# Altium schematic sheet sh_stepper.SchDoc
size 457 x 241 mm
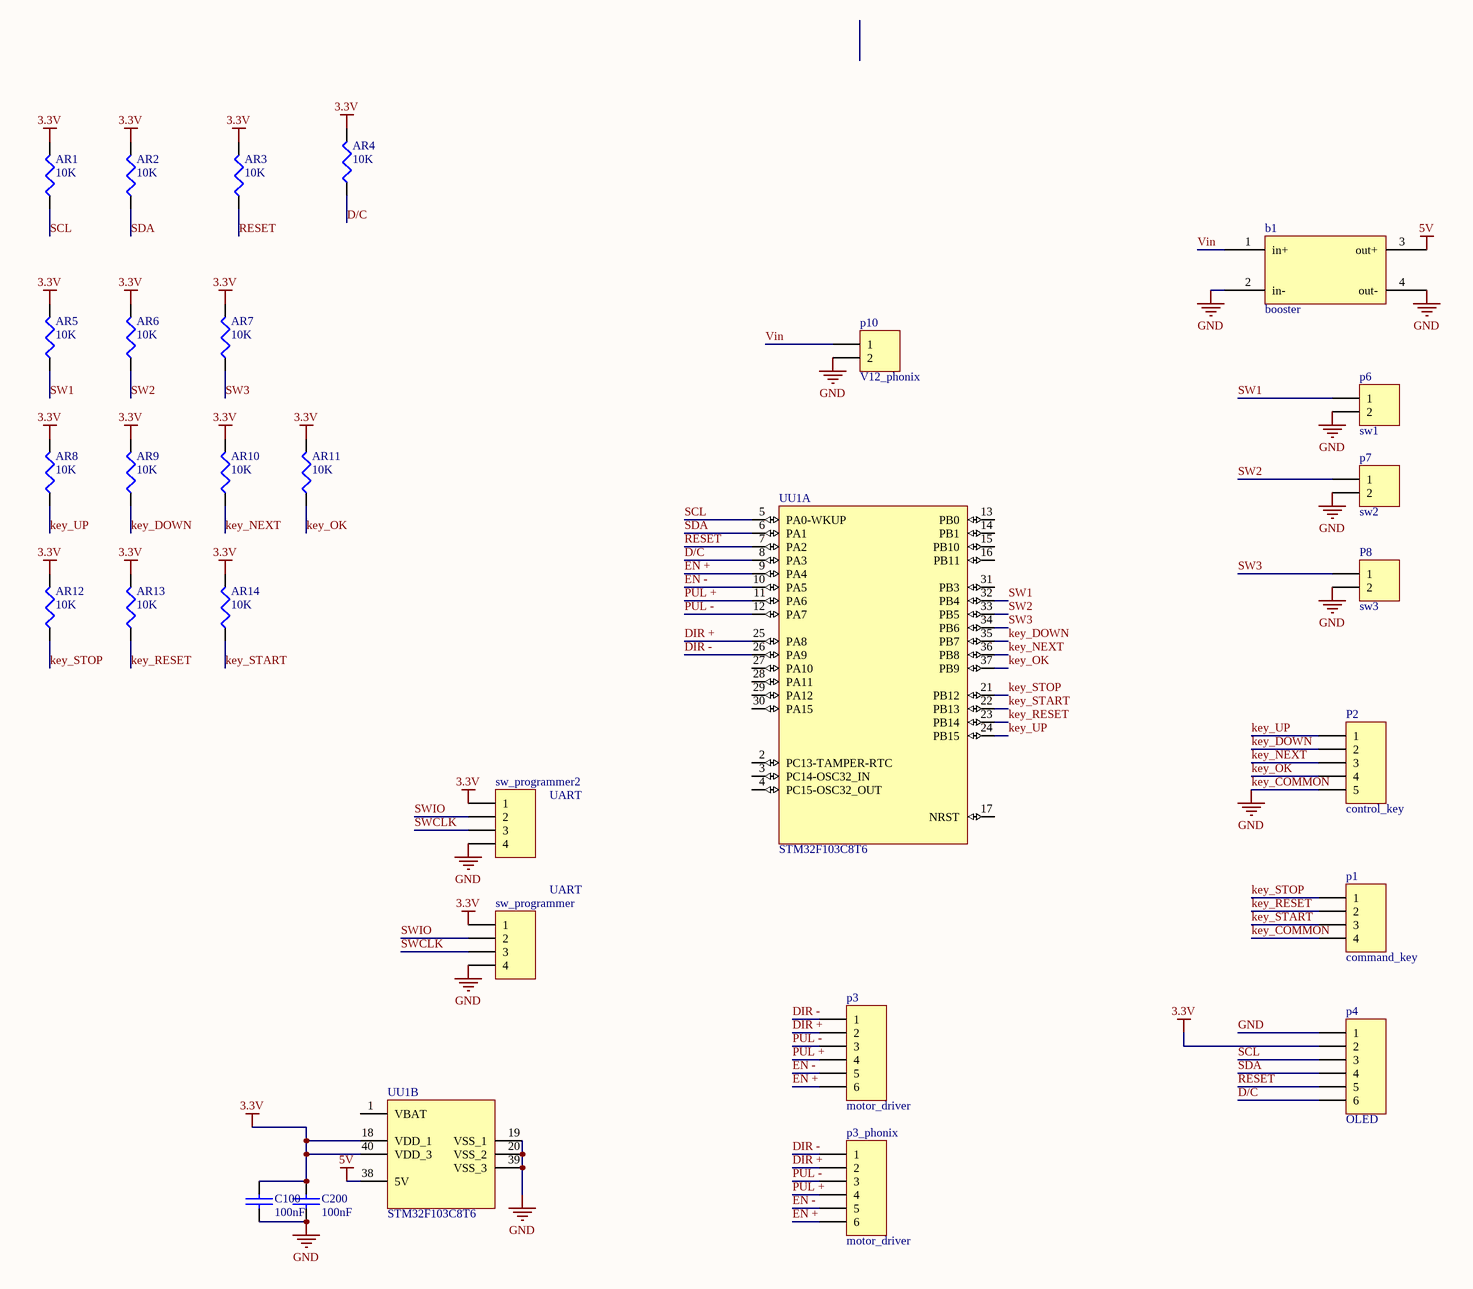
[diagram p0: sh_stepper.SchDoc]

## Parts
AR1  value 10K  [c1206]  (hidden comment: Res3)
AR2  value 10K  [c1206]  (hidden comment: Res3)
AR3  value 10K  [c1206]  (hidden comment: Res3)
AR4  value 10K  [c1206]  (hidden comment: Res3)
AR5  value 10K  [c1206]  (hidden comment: Res3)
AR6  value 10K  [c1206]  (hidden comment: Res3)
AR7  value 10K  [c1206]  (hidden comment: Res3)
AR8  value 10K  [c1206]  (hidden comment: Res3)
AR9  value 10K  [c1206]  (hidden comment: Res3)
AR10  value 10K  [c1206]  (hidden comment: Res3)
AR11  value 10K  [c1206]  (hidden comment: Res3)
AR12  value 10K  [c1206]  (hidden comment: Res3)
AR13  value 10K  [c1206]  (hidden comment: Res3)
AR14  value 10K  [c1206]  (hidden comment: Res3)
b1  booster  [booster]
C100  100nF  [1206]
C200  100nF  [1206]
p1  command_key  [HDR1X4]
P2  control_key  [HDR1X5]
p3  motor_driver  [HDR1X6]
p3_phonix  motor_driver  [phonix6]
p4  OLED  [HDR1X6]
p6  sw1  [HDR1X2]
p7  sw2  [HDR1X2]
P8  sw3  [HDR1X2]
p10  V12_phonix  [phoenix terminal R 2]
sw_programmer  (no value)  [HDR1X4]
sw_programmer2  (no value)  [HDR1X4]
UU1  STM32F103C8T6  [header_board_st_40]  (parts A,B of 2)

## Nets
3.3V: AR1.2 AR2.2 AR3.2 AR4.2 AR5.2 AR6.2 AR7.2 AR8.2 AR9.2 AR10.2 AR11.2 AR12.2 AR13.2 AR14.2 C100.1(+) C200.1(+) p4.2 sw_programmer.1 sw_programmer2.1 UU1.18(VDD_1) UU1.40(VDD_3)
5V: b1.3(out+) UU1.38(5V)
GND: b1.2(in-) b1.4(out-) C100.2(-) C200.2(-) p1.4 P2.5 p4.1 p6.2 p7.2 P8.2 p10.2 sw_programmer.4 sw_programmer2.4 UU1.19(VSS_1) UU1.20(VSS_2) UU1.39(VSS_3)  [also labelled key_COMMON]
D/C: AR4.1 p4.6 UU1.8(PA3)
DIR +: p3.2 p3_phonix.2 UU1.25(PA8)
DIR -: p3.1 p3_phonix.1 UU1.26(PA9)
EN +: p3.6 p3_phonix.6 UU1.9(PA4)
EN -: p3.5 p3_phonix.5 UU1.10(PA5)
key_DOWN: AR9.1 P2.2 UU1.35(PB7)
key_NEXT: AR10.1 P2.3 UU1.36(PB8)
key_OK: AR11.1 P2.4 UU1.37(PB9)
key_RESET: AR13.1 p1.2 UU1.23(PB14)
key_START: AR14.1 p1.3 UU1.22(PB13)
key_STOP: AR12.1 p1.1 UU1.21(PB12)
key_UP: AR8.1 P2.1 UU1.24(PB15)
PUL +: p3.4 p3_phonix.4 UU1.11(PA6)
PUL -: p3.3 p3_phonix.3 UU1.12(PA7)
RESET: AR3.1 p4.5 UU1.7(PA2)
SCL: AR1.1 p4.3 UU1.5(PA0-WKUP)
SDA: AR2.1 p4.4 UU1.6(PA1)
SW1: AR5.1 p6.1 UU1.32(PB4)
SW2: AR6.1 p7.1 UU1.33(PB5)
SW3: AR7.1 P8.1 UU1.34(PB6)
SWCLK: sw_programmer.3 sw_programmer2.3
SWIO: sw_programmer.2 sw_programmer2.2
Vin: b1.1(in+) p10.1

Not connected (* = marked no-connect by the designer): UU1 1(VBAT) 2(PC13-TAMPER-RTC) 3(PC14-OSC32_IN) 4(PC15-OSC32_OUT) 13(PB0) 14(PB1) 15(PB10) 16(PB11) 17(NRST) 27(PA10) 28(PA11) 29(PA12) 30(PA15) 31(PB3)

## Notes on the sheet
- UART

## Library data of the parts
AR1-AR14 = Res3: Resistor; Published: 8-Jun-2000; LatestRevisionDate: 29-May-2009; LatestRevisionNote: IPC-7351 Footprint Added.; PackageReference: J1-0603; Publisher: Altium Limited; PackageDescription: Chip Resistor
C100 C200 = Cap-Bipolar: Bipolar Capacitor; Voltage: 100V; Designer: Saeid Jorablo; Organazation: ControTec; Adding Date: 1387/12/20; Value: 100nF
p1 sw_programmer sw_programmer2 = Header 4: Header, 4-Pin; LatestRevisionDate: 17-Jul-2002; LatestRevisionNote: Re-released for DXP Platform.; Publisher: Altium Limited
P2 = Header 5: Header, 5-Pin; LatestRevisionDate: 17-Jul-2002; LatestRevisionNote: Re-released for DXP Platform.; Publisher: Altium Limited
p3 p3_phonix p4 = Header 6: Header, 6-Pin; LatestRevisionDate: 17-Jul-2002; LatestRevisionNote: Re-released for DXP Platform.; Publisher: Altium Limited
p6 p7 P8 p10 = Header 2: Header, 2-Pin; LatestRevisionDate: 17-Jul-2002; LatestRevisionNote: Re-released for DXP Platform.; Publisher: Altium Limited
UU1 = STM32F103C8T6: ARM Cortex-M3 32-bit MCU, 64 KB Flash, 20 KB Internal RAM, 37 I/Os, 48-pin LQFP, -40 to 85 degC, Tray; A/D Converter: 2x12-bit (10 Channel); FLASH Size (Prog) (kB): 64; I/Os (High Current): 37; Internal RAM Size (kB): 20; Operating Frequency(F) (Processor speed) (MHz): 72; Supply Voltage(Vcc) min (V): 2; DatasheetVersion: Rev. 16; PackageVersion: Rev. 6, 06/2013; PackageReference: LQFP48; PackageDescription: 48-Pin Low Profile Quad Flat Package, 7 x 7 mm Body, 0.5 mm Pitch; Supplier 1: Digi-Key; Supplier Part Number 1: 497-6063-ND; Supplier 2: Farnell; Supplier Part Number 2: 1447637; Supplier 3: Newark; Supplier Part Number 3: 59M2182; Supplier 4: Newark; Supplier Part Number 4: 57P1222; Supplier 5: Mouser; Supplier Part Number 5: 511-STM32F103C8T6; Core: ARM Cortex-M3; Packing: Tray; Mounting Technology: Surface Mount; PartNumber: STM32F103C8T6; ComponentLink1Description: Manufacturer URL; ComponentLink1URL: http://www.st.com/web/en/home.html; ComponentLink2Description: Datasheet; ComponentLink2URL: http://www.st.com/st-web-ui/static/active/en/resource/technical/document/datasheet/CD00161566.pdf; ComponentLink3Description: Package Specification; ComponentLink3URL: http://www.st.com/st-web-ui/static/active/en/resource/technical/document/datasheet/DM00058181.pdf